# Altium schematic sheet 3_classyTKL_MXHS_mcu.SchDoc: ClassyTKL - MXHS
size A4; Address1: github.com/4pplet/classytkl; Address2: Licence: CERN-OHL-S; Revision: A3; SheetNumber: 3; SheetTotal: 3
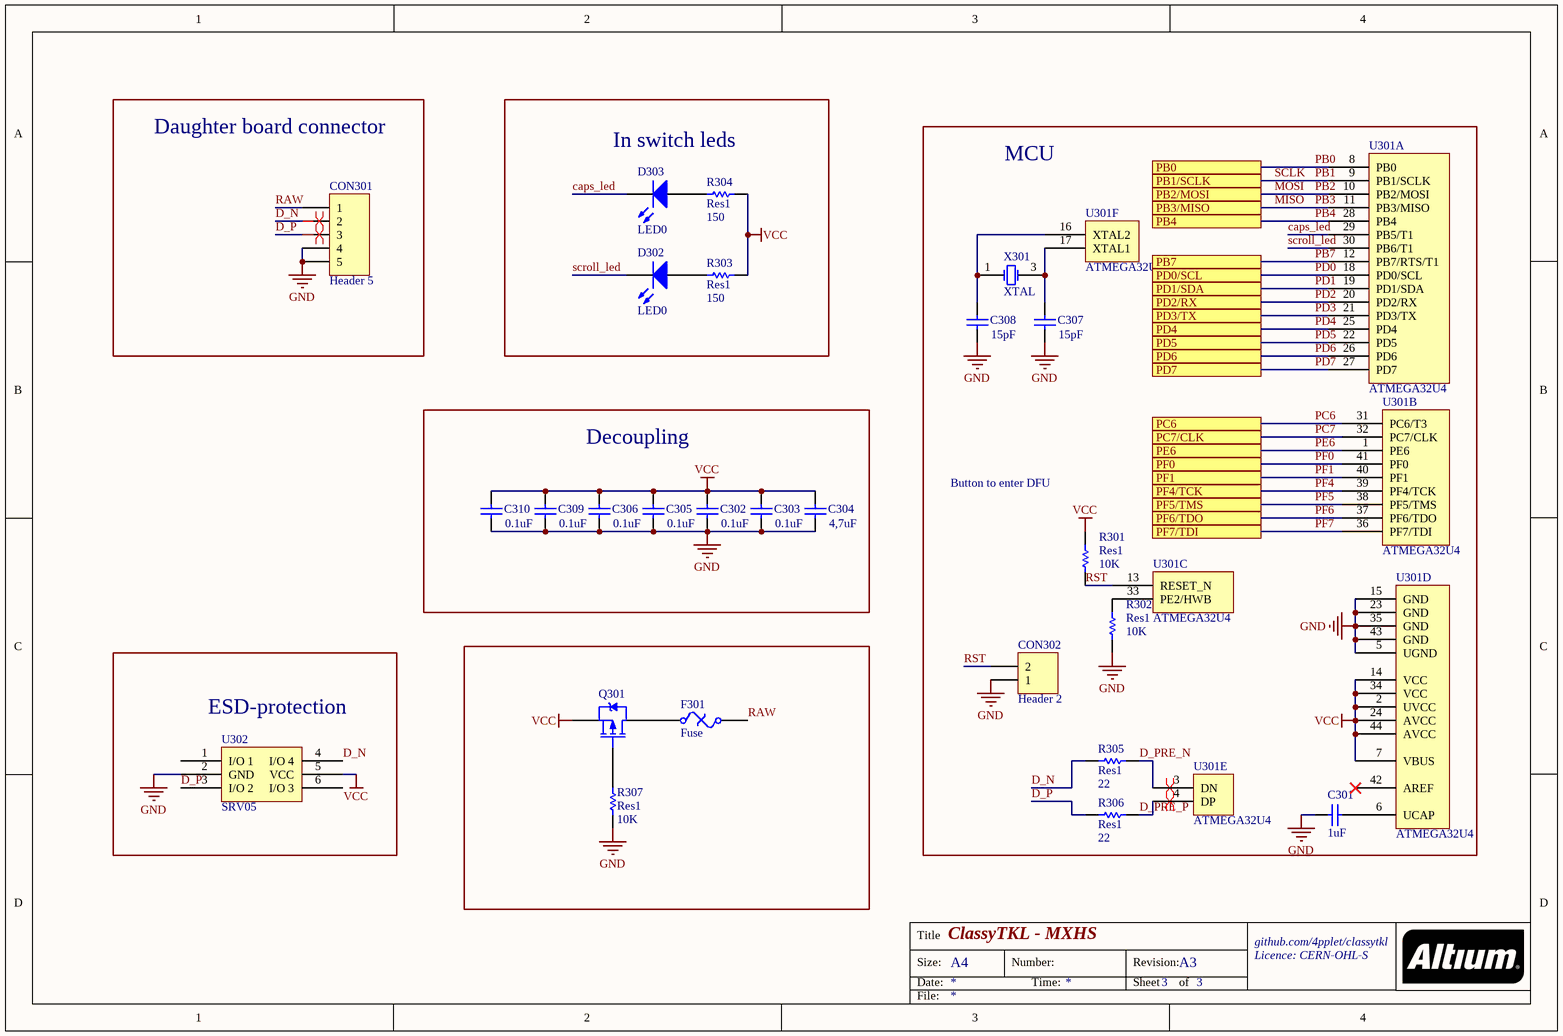
[diagram p0: 3_classyTKL_MXHS_mcu.SchDoc]

## Parts
C301  value 1uF  [C0603[1608]]
C302  value 0.1uF  [C0603[1608]]
C303  value 0.1uF  [C0603[1608]]
C304  value 4,7uF  [C0603[1608]]
C305  value 0.1uF  [C0603[1608]]
C306  value 0.1uF  [C0603[1608]]
C307  value 15pF  [C0603[1608]]
C308  value 15pF  [C0603[1608]]
C309  value 0.1uF  [C0603[1608]]
C310  value 0.1uF  [C0603[1608]]
CON301  Header 5  [JST SM04B-SRSS-TB]
CON302  Header 2  [HDR1X2]  (no BOM)
D302  LED0  [MX-switch - LED]  (no BOM)
D303  LED0  [MX-switch - LED]  (no BOM)
F301  Fuse  [C1206[3216]]
Q301  PMOS-2  [SOT-23-3]  (value not drawn)
R301  Res1  value 10K  [R0603[1608]]
R302  Res1  value 10K  [R0603[1608]]
R303  Res1  value 150  [R0603[1608] - THT]  (no BOM)
R304  Res1  value 150  [R0603[1608] - THT]  (no BOM)
R305  Res1  value 22  [R0603[1608]]
R306  Res1  value 22  [R0603[1608]]
R307  Res1  value 10K  [R0603[1608]]
U301  ATMEGA32U4  [ATMEGA32U4-COMBO]  (parts A,B,C,D,E,F of 6)
U302  SRV05  [SOT-23-6]
X301  XTAL  [XTAL-3225]

## Blocks framed on the sheet
Daughter board connector: CON301
In switch leds: D302 D303 R303 R304
MCU: C301 C307 C308 CON302 R301 R302 R305 R306 U301 X301
Decoupling: C302-C306 C309 C310
ESD-protection: U302

## Ports
PB0, PB1/SCLK, PB2/MOSI, PB3/MISO, PB4, PB7, PC6, PC7/CLK, PD0/SCL, PD1/SDA, PD2/RX, PD3/TX, PD4, PD5, PD6, PD7, PE6, PF0, PF1, PF4/TCK, PF5/TMS, PF6/TDO, PF7/TDI

## Nets
GND: C301.1 C302.1 C303.1 C304.1 C305.1 C306.1 C307.1 C308.1 C309.1 C310.1 CON301.4 CON301.5 CON302.1 R302.2 R307.2 U301.5(UGND) U301.15(GND) U301.23(GND) U301.35(GND) U301.43(GND) U302.2(GND) X301.2(GND) X301.4(GND)
VCC: C302.2 C303.2 C304.2 C305.2 C306.2 C309.2 C310.2 Q301.2(S) R301.1 R303.1 R304.1 U301.2(UVCC) U301.7(VBUS) U301.14(VCC) U301.24(AVCC) U301.34(VCC) U301.44(AVCC) U302.5(VCC)
caps_led: D303.2(K) U301.29(PB5/T1)
D_N: CON301.2 R305.2 U302.4(I/O_4)
D_P: CON301.3 R306.2 U302.3(I/O_2)
D_PRE_N: R305.1 U301.3(DN)
D_PRE_P: R306.1 U301.4(DP)
MISO: U301.11(PB3/MISO) ; port PB3/MISO  [also labelled PB3]
MOSI: U301.10(PB2/MOSI) ; port PB2/MOSI  [also labelled PB2]
PB0: U301.8(PB0) ; port PB0
PB1: U301.9(PB1/SCLK) ; port PB1/SCLK  [also labelled SCLK]
PB4: U301.28(PB4) ; port PB4
PB7: U301.12(PB7/RTS/T1) ; port PB7
PC6: U301.31(PC6/T3) ; port PC6
PC7: U301.32(PC7/CLK) ; port PC7/CLK
PD0: U301.18(PD0/SCL) ; port PD0/SCL
PD1: U301.19(PD1/SDA) ; port PD1/SDA
PD2: U301.20(PD2/RX) ; port PD2/RX
PD3: U301.21(PD3/TX) ; port PD3/TX
PD4: U301.25(PD4) ; port PD4
PD5: U301.22(PD5) ; port PD5
PD6: U301.26(PD6) ; port PD6
PD7: U301.27(PD7) ; port PD7
PE6: U301.1(PE6) ; port PE6
PF0: U301.41(PF0) ; port PF0
PF1: U301.40(PF1) ; port PF1
PF4: U301.39(PF4/TCK) ; port PF4/TCK
PF5: U301.38(PF5/TMS) ; port PF5/TMS
PF6: U301.37(PF6/TDO) ; port PF6/TDO
PF7: U301.36(PF7/TDI) ; port PF7/TDI
RAW: CON301.1 F301.1
RST: CON302.2 R301.2 U301.13(RESET_N)
scroll_led: D302.2(K) U301.30(PB6/T1)
NetC301_2: C301.2 U301.6(UCAP)
NetC307_2: C307.2 U301.17(XTAL1) X301.3(OSC2)
NetC308_2: C308.2 U301.16(XTAL2) X301.1(OSC1)
NetD302_1: D302.1(A) R303.2
NetD303_1: D303.1(A) R304.2
NetF301_2: F301.2 Q301.3(D)
NetQ301_1: Q301.1(G) R307.1
NetR302_1: R302.1 U301.33(PE2/HWB)

Not connected (* = marked no-connect by the designer): U301 42(AREF)*; U302 1(I/O_1) 6(I/O_3)

## Layout directives
differential pair: D_N, D_P, D_PRE_N, D_PRE_P

## Notes on the sheet
- Button to enter DFU
- Title
- Size:
- Date:
- A4
- Number:
- Time:
- Revision:
- Sheet
- of
- File:

## Library data of the parts
C301 = Cap: Capacitor; MRF.Part: CL10A105KB8NNNC; MFG: KEMET; MFGPN: C0603C104M5RACTU; LCSC MFG: Samsung Electro-Mechanics; Version: 0603 imperial; LCSC Part #: C15849
C302 C303 C305 C306 C309 C310 = Cap: Capacitor; MRF.Part: CC0603KRX7R9BB104; MFG: KEMET; MFGPN: C0603C104M5RACTU; LCSC MFG: YAGEO; Version: 0603 imperial; LCSC Part #: C14663
C304 = Cap: Capacitor; MRF.Part: CL10A475KO8NNNC; LCSC MFG: Samsung Electro-Mechanics; LCSC Part #: C19666
C307 C308 = Cap: Capacitor; MRF.Part: CL10C150JB8NNNC; LCSC MFG: Samsung Electro-Mechanics; Version: 0603 imperial; LCSC Part #: C1644
CON301 = Header 5: JST for USB daughter board; MFGPN: SM04B-SRSS-TB(LF)(SN); MFG: JST Sales America Inc.; LCSC MFG: JST Sales America; LCSC Part #: C160404; MRF.Part: SM04B-SRSS-TB(LF)(SN)
CON302 = Header 2: Header, 2-Pin
D302 D303 = LED0: Typical INFRARED GaAs LED
F301 = Fuse Thermal: Thermal Fuse; MRF.Part: ASMD1206-050; MFG: Bel Fuse Inc.; MFGPN: 0ZCJ0050FF2G; LCSC MFG: Shenzhen JDT Fuse; LCSC Part #: C135338
Q301 = PMOS-2: P-Channel Power MOSFET; MRF.Part: SI2301CDS-T1-GE3; LCSC MFG: Vishay Intertech; LCSC Part #: C10487; Version: SOT23-3
R301 R302 R307 = Res1: Resistor; MRF.Part: 0603WAF1002T5E; MFG: Panasonic Electronic Components; MFGPN: ERJ-3EKF5101V; LCSC MFG: Uniroyal Elec; Version: 0603 imperial; LCSC Part #: C25804
R303 R304 = Res1: Resistor; Version: 0603 imperial
R305 R306 = Res1: Resistor; MRF.Part: 0603WAF220JT5E; MFG: Panasonic Electronic Components; MFGPN: ERJ-3EKF5101V; LCSC MFG: Uniroyal Elec; Version: 0603 imperial; LCSC Part #: C23345
U301 = ATMEGA32U4: MCU; LCSC MFG: Microchip Tech; MFG: Microchip Technology; MFGPN: ATMEGA32U4-MUR; LCSC Part #: C45874; MRF.Part: ATMEGA32U4-MUR
U302 = SRV05: MRF.Part: SRV05-4-P-T7; LCSC MFG: ProTek Devices; LCSC Part #: C85364
X301 = XTAL: Crystal Oscillator; MRF.Part: X322516MLB4SI; LCSC MFG: Yangxing Tech; LCSC Part #: C13738